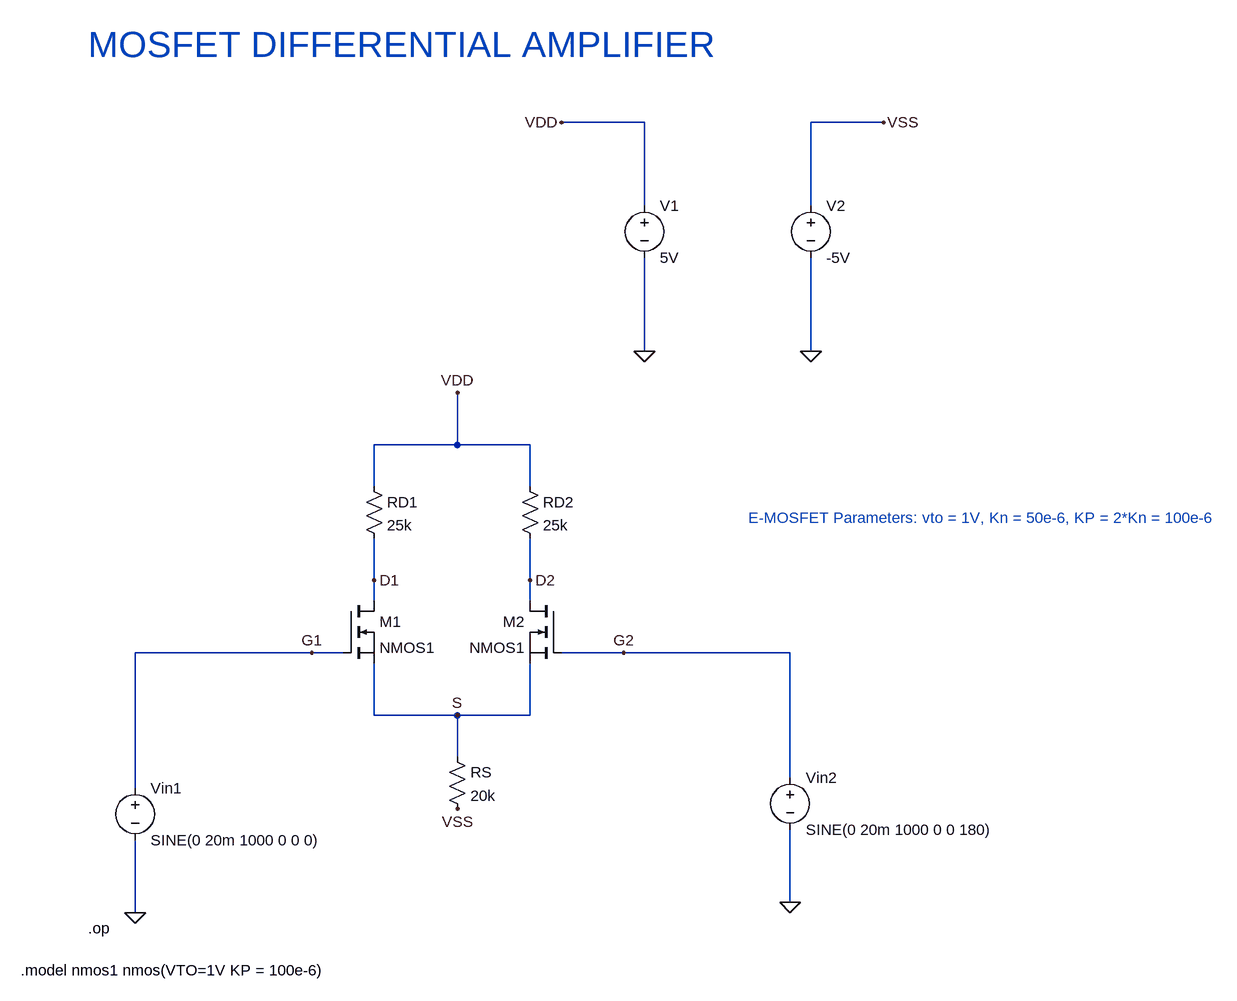
[diagram p0: schematic Differential_amplifier_DC.asc]
Differential_amplifier_DC.asc, the LTspice schematic file:
Version 4.1
SHEET 1 1700 696
WIRE 640 -624 512 -624
WIRE 1008 -624 896 -624
WIRE 640 -496 640 -624
WIRE 896 -496 896 -624
WIRE 640 -272 640 -416
WIRE 896 -272 896 -416
WIRE 352 -128 352 -208
WIRE 352 -128 224 -128
WIRE 464 -128 352 -128
WIRE 224 -64 224 -128
WIRE 464 -64 464 -128
WIRE 224 80 224 16
WIRE 464 80 464 16
WIRE 224 112 224 80
WIRE 464 112 464 80
WIRE 128 192 -144 192
WIRE 176 192 128 192
WIRE 608 192 512 192
WIRE 864 192 608 192
WIRE 224 288 224 208
WIRE 352 288 224 288
WIRE 464 288 464 208
WIRE 464 288 352 288
WIRE 352 352 352 288
WIRE 864 384 864 192
WIRE -144 400 -144 192
WIRE 864 576 864 464
WIRE -144 592 -144 480
FLAG 640 -272 0
FLAG 896 -272 0
FLAG 512 -624 VDD
FLAG 1008 -624 VSS
FLAG 352 -208 VDD
FLAG 352 432 VSS
FLAG -144 592 0
FLAG 864 576 0
FLAG 224 80 D1
FLAG 464 80 D2
FLAG 352 288 S
FLAG 128 192 G1
FLAG 608 192 G2
SYMBOL nmos 176 112 R0
SYMATTR InstName M1
SYMATTR Value NMOS1
SYMBOL nmos 512 112 M0
SYMATTR InstName M2
SYMATTR Value NMOS1
SYMBOL res 208 -80 R0
SYMATTR InstName RD1
SYMATTR Value 25k
SYMBOL res 448 -80 R0
SYMATTR InstName RD2
SYMATTR Value 25k
SYMBOL res 336 336 R0
SYMATTR InstName RS
SYMATTR Value 20k
SYMBOL voltage 640 -512 R0
WINDOW 123 0 0 Left 0
WINDOW 39 0 0 Left 0
SYMATTR InstName V1
SYMATTR Value 5V
SYMBOL voltage 896 -512 R0
WINDOW 123 0 0 Left 0
WINDOW 39 0 0 Left 0
SYMATTR InstName V2
SYMATTR Value -5V
SYMBOL voltage -144 384 R0
WINDOW 123 0 0 Left 0
WINDOW 39 0 0 Left 0
SYMATTR InstName Vin1
SYMATTR Value SINE(0 20m 1000 0 0 0)
SYMBOL voltage 864 368 R0
WINDOW 123 0 0 Left 0
WINDOW 39 0 0 Left 0
SYMATTR InstName Vin2
SYMATTR Value SINE(0 20m 1000 0 0 180)
TEXT -216 -744 Left 5 ;MOSFET DIFFERENTIAL AMPLIFIER
TEXT -216 616 Left 2 !.op
TEXT 800 -16 Left 2 ;E-MOSFET Parameters: vto = 1V, Kn = 50e-6, KP = 2*Kn = 100e-6
TEXT -320 680 Left 2 !.model nmos1 nmos(VTO=1V KP = 100e-6)

The netlist it stands for:
* Differential_amplifier_DC.asc
M1 D1 G1 S S NMOS1
M2 D2 G2 S S NMOS1
RD1 VDD D1 25k
RD2 VDD D2 25k
RS S VSS 20k
V1 VDD 0 5V
V2 VSS 0 -5V
Vin1 G1 0 SINE(0 20m 1000 0 0 0)
Vin2 G2 0 SINE(0 20m 1000 0 0 180)
.model NMOS NMOS
.model PMOS PMOS
.lib standard.mos
* MOSFET DIFFERENTIAL AMPLIFIER
.op
* E-MOSFET Parameters: vto = 1V, Kn = 50e-6, KP = 2*Kn = 100e-6
.model nmos1 nmos(VTO=1V KP = 100e-6)
.backanno
.end